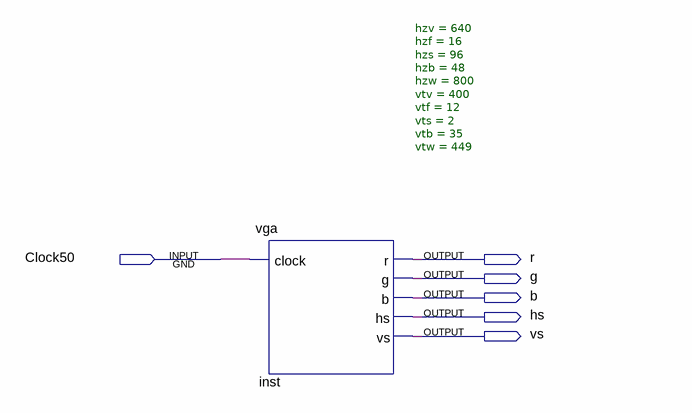
[diagram p0: schematic sheet]
// Quartus schematic greyscreen.bdf as structural Verilog: 1 symbols, 6 pins
module greyscreen (
  input  Clock50,
  output r,
  output g,
  output b,
  output hs,
  output vs
);

  vga #(.hzv(640), .hzf(16), .hzs(96), .hzb(48), .hzw(800), .vtv(400), .vtf(12), .vts(2), .vtb(35), .vtw(449)) inst (
    .clock(Clock50), .r(r), .g(g), .b(b), .hs(hs), .vs(vs));
endmodule
